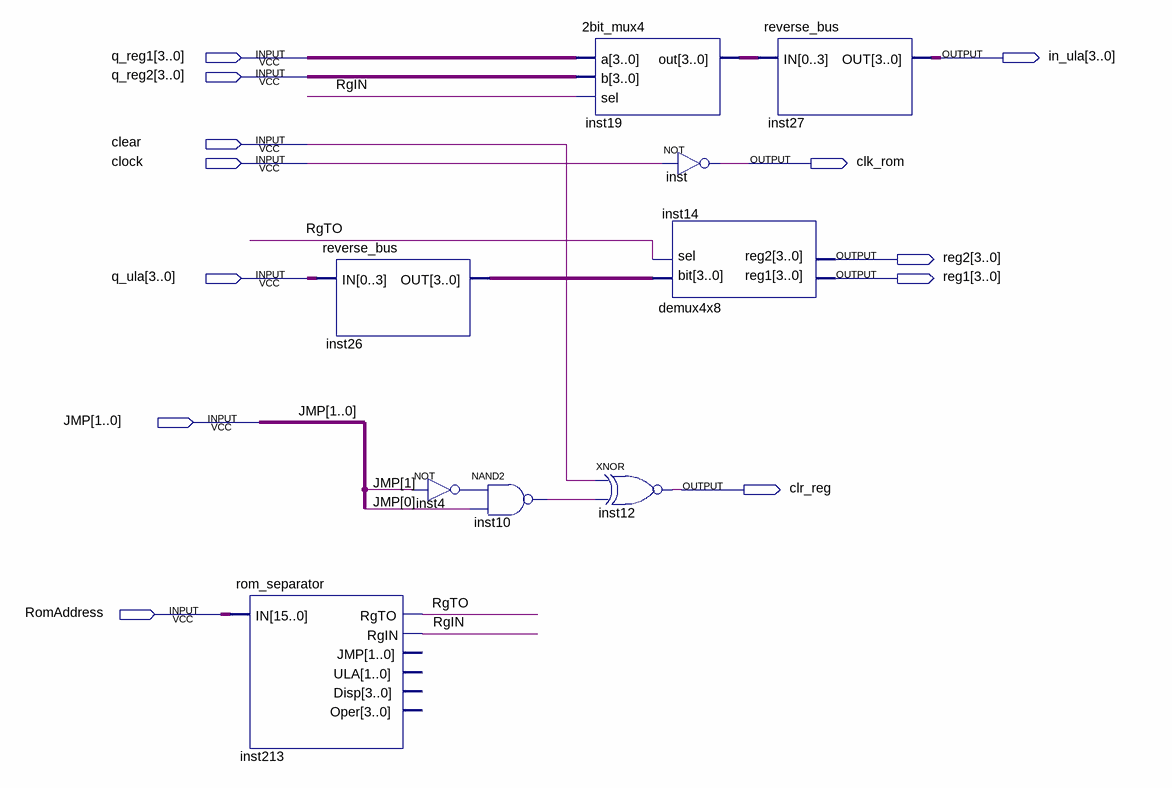
[diagram p0: schematic sheet]
// Quartus schematic UC.bdf as structural Verilog: 9 symbols, 12 pins
module UC (
  input  [3:0] q_reg1,
  input  [3:0] q_reg2,
  input  clear,
  input  clock,
  input  [3:0] q_ula,
  input  [1:0] JMP,
  input  RomAddress,
  output [3:0] in_ula,
  output clk_rom,
  output [3:0] reg2,
  output [3:0] reg1,
  output clr_reg
);

  wire inst4_out, inst10_out, RgIN, RgTO;
  wire [3:0] inst19_out, inst26_out;
  wire [15:0] undriven;

  rom_separator inst213 (.IN(undriven), .RgTO(RgTO), .RgIN(RgIN));  // open: JMP, ULA, Disp, Oper
  reverse_bus inst26 (.IN(q_ula), .OUT(inst26_out));
  not inst4 (inst4_out, JMP[1]);
  nand inst10 (inst10_out, inst4_out, JMP[0]);
  \2bit_mux4  inst19 (.a(q_reg1), .b(q_reg2), .sel(RgIN), .out(inst19_out));
  xnor inst12 (clr_reg, clear, inst10_out);
  not inst (clk_rom, clock);
  demux4x8 inst14 (.\bit (inst26_out), .sel(RgTO), .reg1(reg1), .reg2(reg2));
  reverse_bus inst27 (.IN(inst19_out), .OUT(in_ula));
endmodule
